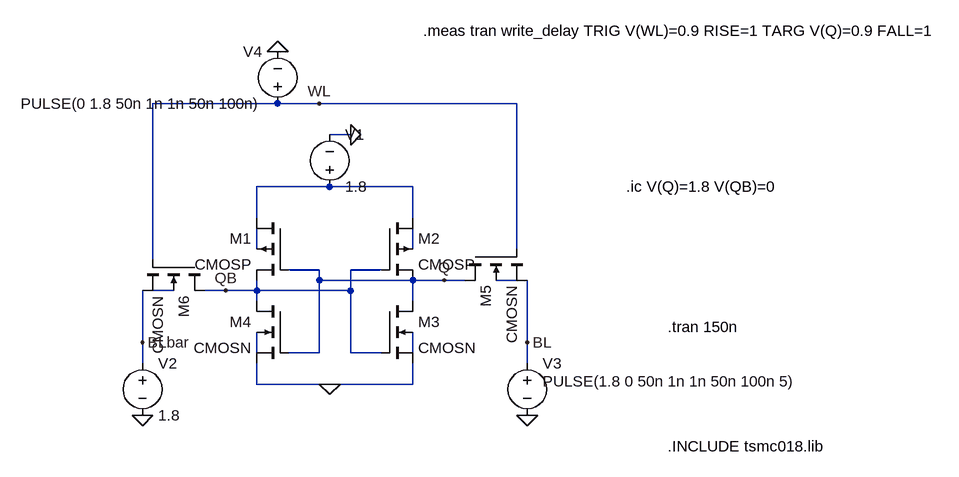
[diagram p0: schematic 6T_SRAM.asc]
6T_SRAM.asc, the LTspice schematic file:
Version 4
SHEET 1 1168 680
WIRE 96 -112 -96 -112
WIRE 160 -112 96 -112
WIRE 464 -112 160 -112
WIRE 208 -64 176 -64
WIRE 176 16 64 16
WIRE 304 16 176 16
WIRE 64 64 64 16
WIRE 304 64 304 16
WIRE 64 112 64 80
WIRE 304 112 304 80
WIRE 464 112 464 -112
WIRE -96 128 -96 -112
WIRE 160 144 112 144
WIRE 256 144 208 144
WIRE 160 160 160 144
WIRE 304 160 160 160
WIRE 352 160 304 160
WIRE 384 160 352 160
WIRE 464 160 432 160
WIRE -64 176 -96 176
WIRE 16 176 -16 176
WIRE 64 176 64 160
WIRE 64 176 16 176
WIRE 208 176 208 144
WIRE 208 176 64 176
WIRE 64 192 64 176
WIRE 304 192 304 160
WIRE -112 256 -112 176
WIRE 480 256 480 160
WIRE 64 272 64 240
WIRE 160 272 160 160
WIRE 160 272 112 272
WIRE 208 272 208 176
WIRE 256 272 208 272
WIRE 304 272 304 240
WIRE -112 288 -112 256
WIRE 480 288 480 256
WIRE 64 320 64 288
WIRE 176 320 64 320
WIRE 304 320 304 288
WIRE 304 320 176 320
FLAG 176 320 0
FLAG 208 -64 0
FLAG 352 160 Q
FLAG 16 176 QB
FLAG 480 256 BL
FLAG -112 256 BLbar
FLAG 160 -112 WL
FLAG -112 368 0
FLAG 480 368 0
FLAG 96 -192 0
SYMBOL cmosp 256 64 R0
SYMATTR InstName M2
SYMATTR Value2 l=180n w=900n
SYMBOL cmosn 256 192 R0
SYMATTR InstName M3
SYMATTR Value2 l=180n w=900n
SYMBOL cmosp 112 64 M0
SYMATTR InstName M1
SYMATTR Value2 l=180n w=900n
SYMBOL cmosn 112 192 M0
SYMATTR InstName M4
SYMATTR Value2 l=180n w=900n
SYMBOL voltage 176 32 M180
WINDOW 0 24 96 Left 2
WINDOW 3 24 16 Left 2
WINDOW 123 0 0 Left 0
WINDOW 39 0 0 Left 0
SYMATTR InstName V1
SYMATTR Value 1.8
SYMBOL cmosn 384 112 M90
SYMATTR InstName M5
SYMATTR Value2 l=180n w=900n
SYMBOL cmosn -16 128 R90
SYMATTR InstName M6
SYMATTR Value2 l=180n w=900n
SYMBOL voltage -112 272 R0
WINDOW 123 0 0 Left 0
WINDOW 39 0 0 Left 0
SYMATTR InstName V2
SYMATTR Value 1.8
SYMBOL voltage 480 272 R0
WINDOW 3 24 44 Left 2
WINDOW 123 0 0 Left 0
WINDOW 39 0 0 Left 0
SYMATTR InstName V3
SYMATTR Value PULSE(1.8 0 50n 1n 1n 50n 100n 5)
SYMBOL voltage 96 -96 R180
WINDOW 0 24 96 Left 2
WINDOW 3 24 16 Left 2
WINDOW 123 0 0 Left 0
WINDOW 39 0 0 Left 0
SYMATTR InstName V4
SYMATTR Value PULSE(0 1.8 50n 1n 1n 50n 100n)
TEXT 696 232 Left 2 !.tran 150n
TEXT 696 416 Left 2 !.INCLUDE tsmc018.lib
TEXT 632 16 Left 2 !.ic V(Q)=1.8 V(QB)=0
TEXT 320 -224 Left 2 !.meas tran write_delay TRIG V(WL)=0.9 RISE=1 TARG V(Q)=0.9 FALL=1

The netlist it stands for:
* 6T_SRAM.asc
M2 N001 QB Q N003 CMOSP l=180n w=900n
M3 Q QB 0 N007 CMOSN l=180n w=900n
M1 N001 Q QB N002 CMOSP l=180n w=900n
M4 QB Q 0 N006 CMOSN l=180n w=900n
V1 N001 0 1.8
M5 Q WL BL N004 CMOSN l=180n w=900n
M6 QB WL BLbar N005 CMOSN l=180n w=900n
V2 BLbar 0 1.8
V3 BL 0 PULSE(1.8 0 50n 1n 1n 50n 100n 5)
V4 WL 0 PULSE(0 1.8 50n 1n 1n 50n 100n)
.model NMOS NMOS
.model PMOS PMOS
.lib standard.mos
.tran 150n
.INCLUDE tsmc018.lib
.ic V(Q)=1.8 V(QB)=0
.meas tran write_delay TRIG V(WL)=0.9 RISE=1 TARG V(Q)=0.9 FALL=1
.backanno
.end